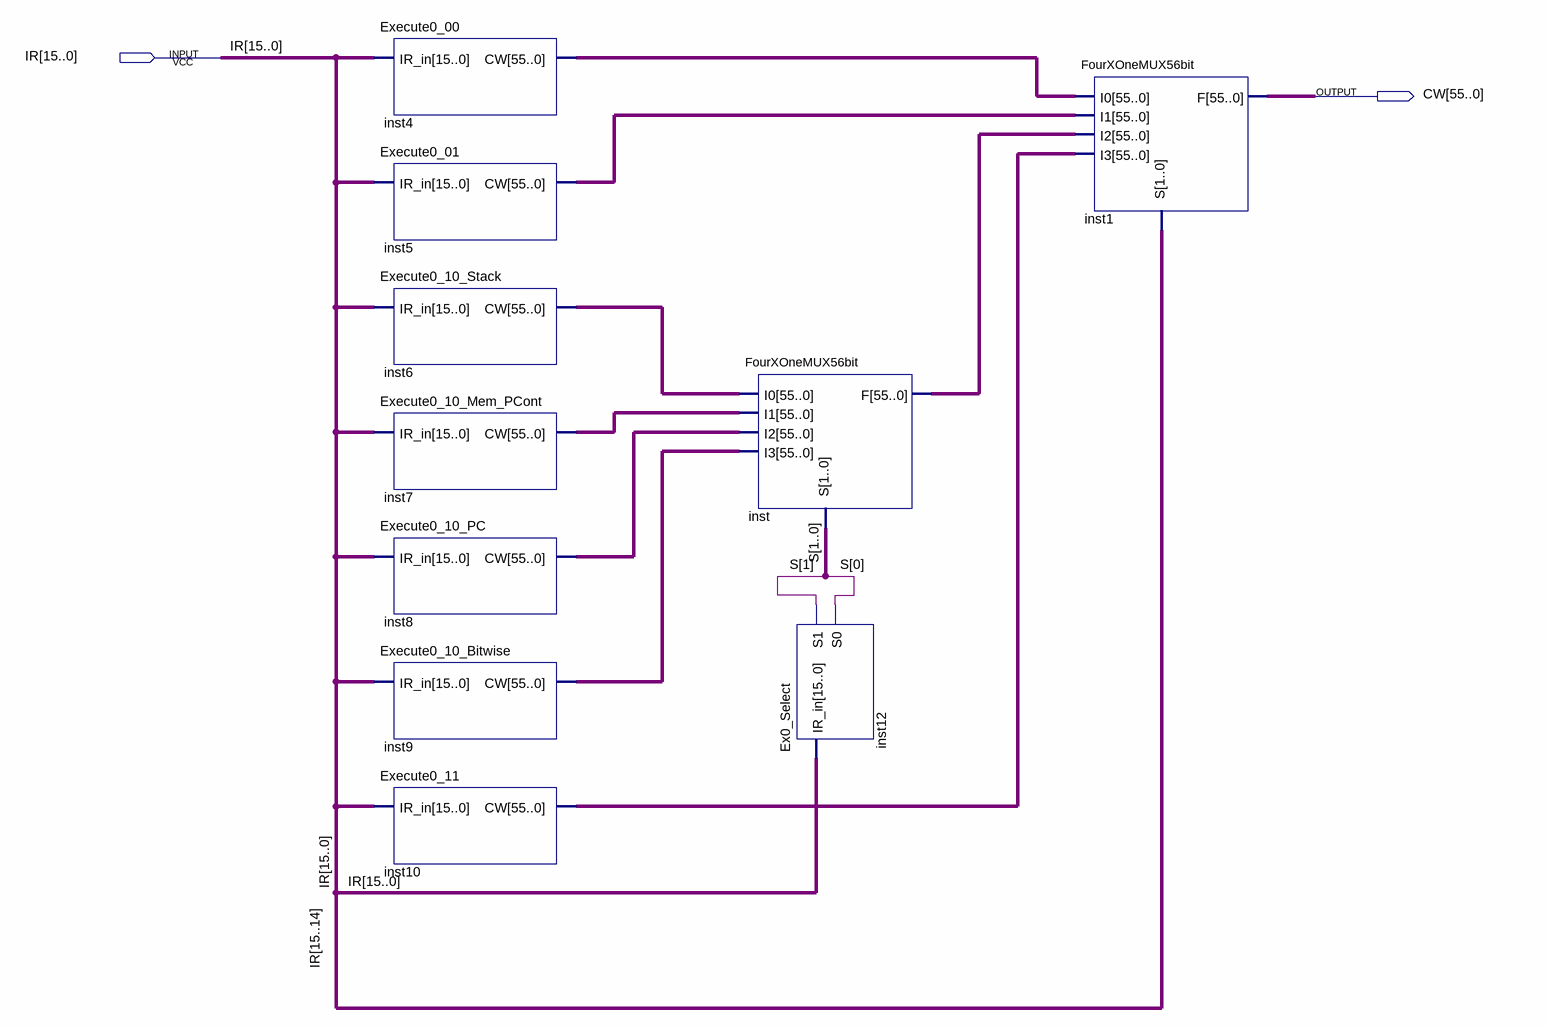
[diagram p0: schematic sheet]
// Quartus schematic Execute0.bdf as structural Verilog: 10 symbols, 2 pins
module Execute0 (
  input  [15:0] IR,
  output [55:0] CW
);

  wire [1:0] S;
  wire [55:0] inst4_cw, inst5_cw, inst6_cw, inst7_cw, inst8_cw, inst9_cw, inst10_cw, inst_f;

  Execute0_00 inst4 (.IR_in(IR), .CW(inst4_cw));
  Execute0_01 inst5 (.IR_in(IR), .CW(inst5_cw));
  Execute0_10_Stack inst6 (.IR_in(IR), .CW(inst6_cw));
  Execute0_10_Mem_PCont inst7 (.IR_in(IR), .CW(inst7_cw));
  Execute0_10_PC inst8 (.IR_in(IR), .CW(inst8_cw));
  Execute0_10_Bitwise inst9 (.IR_in(IR), .CW(inst9_cw));
  Execute0_11 inst10 (.IR_in(IR), .CW(inst10_cw));
  FourXOneMUX56bit inst (.I0(inst6_cw), .I1(inst7_cw), .I2(inst8_cw), .I3(inst9_cw), .S(S), .F(inst_f));
  Ex0_Select inst12 (.IR_in(IR), .S1(S[1]), .S0(S[0]));
  FourXOneMUX56bit inst1 (.I0(inst4_cw), .I1(inst5_cw), .I2(inst_f), .I3(inst10_cw), .S(IR[15:14]), .F(CW));
endmodule
